# Altium schematic sheet Sheet4.SchDoc
size A
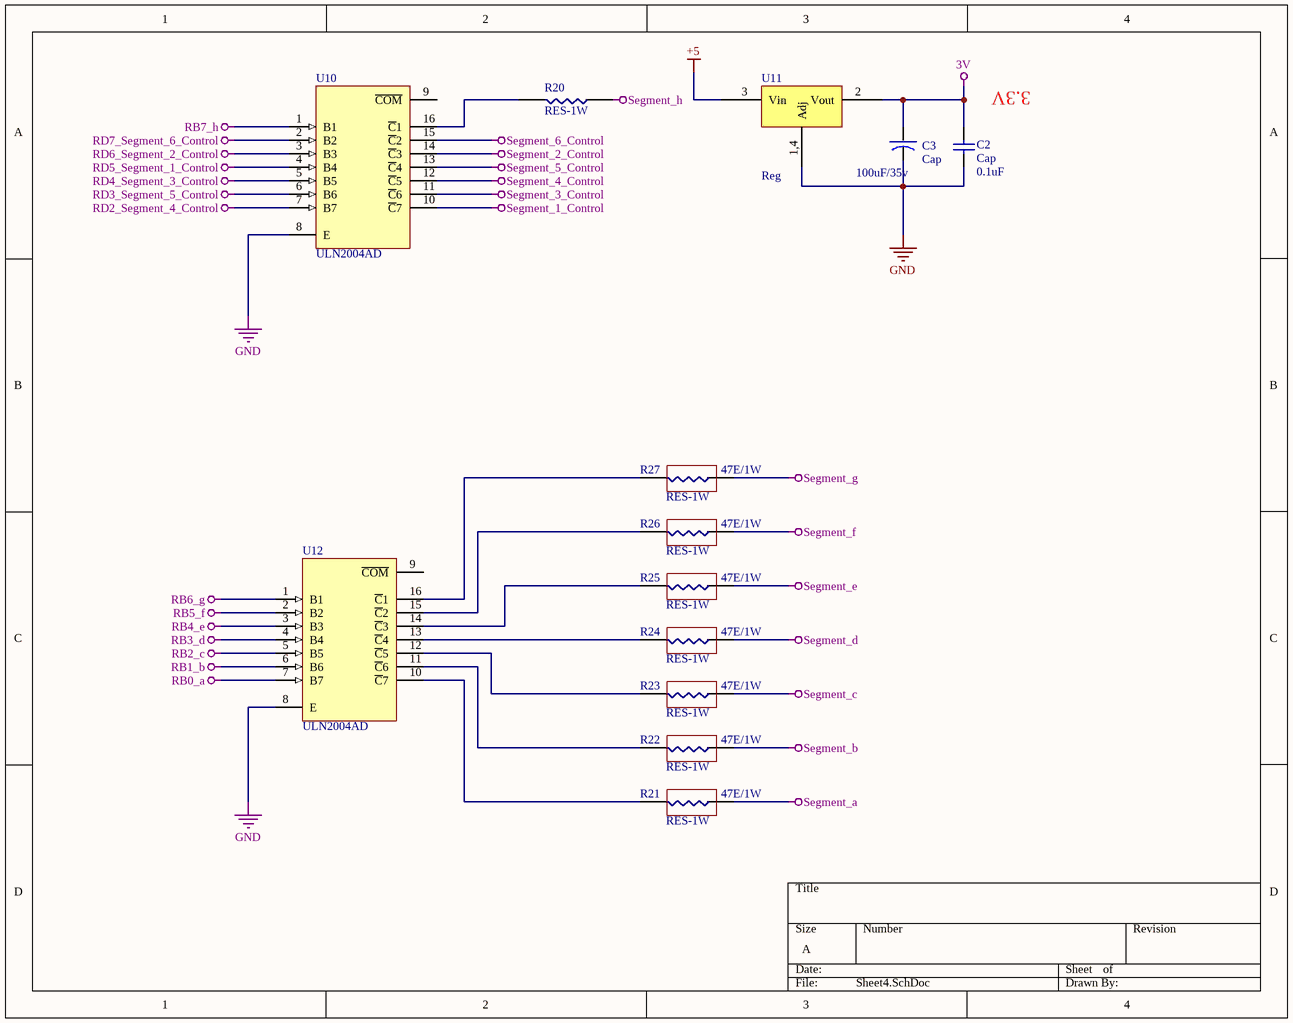
[diagram p0: Sheet4.SchDoc]

## Parts
C2  Cap  [RES0805]
C3  Cap  value 100uF/35v  [Capacitor10UF/63V]
R20  RES-1W  [RES-1W]
R21  RES-1W  value 47E/1W  [RES-1W]
R22  RES-1W  value 47E/1W  [RES-1W]
R23  RES-1W  value 47E/1W  [RES-1W]
R24  RES-1W  value 47E/1W  [RES-1W]
R25  RES-1W  value 47E/1W  [RES-1W]
R26  RES-1W  value 47E/1W  [RES-1W]
R27  RES-1W  value 47E/1W  [RES-1W]
U10  ULN2004AD  [D016_N]
U11  Reg  [LM1117]
U12  ULN2004AD  [D016_N]

## Nets
3V: C2.2(A) C3.1(a) U11.2(Vout)
+5: U11.3(Vin)
GND: C2.1(A) C3.2(b) U10.8(E) U11.1,4(Adj) U12.8(E)
RB0_a: U12.7(B7)
RB1_b: U12.6(B6)
RB2_c: U12.5(B5)
RB3_d: U12.4(B4)
RB4_e: U12.3(B3)
RB5_f: U12.2(B2)
RB6_g: U12.1(B1)
RB7_h: U10.1(B1)
RD2_Segment_4_Control: U10.7(B7)
RD3_Segment_5_Control: U10.6(B6)
RD4_Segment_3_Control: U10.5(B5)
RD5_Segment_1_Control: U10.4(B4)
RD6_Segment_2_Control: U10.3(B3)
RD7_Segment_6_Control: U10.2(B2)
Segment_1_Control: U10.10(~{C}7)
Segment_2_Control: U10.14(~{C}3)
Segment_3_Control: U10.11(~{C}6)
Segment_4_Control: U10.12(~{C}5)
Segment_5_Control: U10.13(~{C}4)
Segment_6_Control: U10.15(~{C}2)
Segment_a: R21.2
Segment_b: R22.2
Segment_c: R23.2
Segment_d: R24.2
Segment_e: R25.2
Segment_f: R26.2
Segment_g: R27.2
Segment_h: R20.2
NetR20_1: R20.1 U10.16(~{C}1)
NetR21_1: R21.1 U12.10(~{C}7)
NetR22_1: R22.1 U12.11(~{C}6)
NetR23_1: R23.1 U12.12(~{C}5)
NetR24_1: R24.1 U12.13(~{C}4)
NetR25_1: R25.1 U12.14(~{C}3)
NetR26_1: R26.1 U12.15(~{C}2)
NetR27_1: R27.1 U12.16(~{C}1)

Not connected (* = marked no-connect by the designer): U10 9(~{COM}); U12 9(~{COM})

## Notes on the sheet
- (near C2) 3.3V
- (in symbol CAP_104_SMD) 0.1uF

## Library data of the parts
C2 = CAP_104_SMD
C3 = Cap-10uf/63V: Cap10uf/63V
U10 U12 = ULN2004AD: Darlington Transistor Array; Published: 15-May-2002; LatestRevisionDate: 13-Apr-2006; LatestRevisionNote: IPC-7351 Footprint Added.; DatasheetVersion: Sep-1986; PackageVersion: Jan-1998; PackageReference: D016; Publisher: Altium Limited; PackageDescription: 16-Pin Small Outline Integrated Circuit 1.27 mm Pitch; Code_IPC: SOIC127P600-16; ComponentLink1Description: Manufacturer Link; ComponentLink1URL: http://www.ti.com/; ComponentLink2Description: Datasheet; ComponentLink2URL: http://www-s.ti.com/sc/ds/uln2004a.pdf
U11 = LM1117